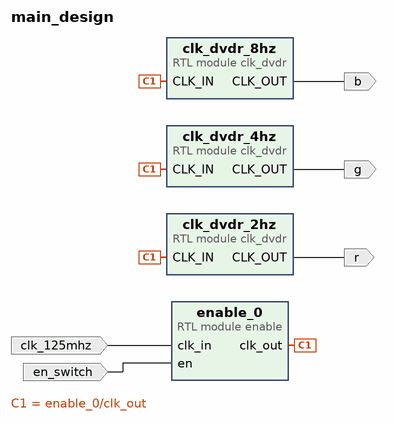
[diagram p0: block diagram of the top level]
# Vivado block design main_design, xc7z020clg400-1, Vivado 2022.1
create_bd_design main_design

create_bd_port -dir I -type clk clk_125mhz
set_property -dict {CONFIG.FREQ_HZ 125000000} [get_bd_ports clk_125mhz]
create_bd_port -dir O r
create_bd_port -dir O g
create_bd_port -dir O b
create_bd_port -dir I en_switch

create_bd_cell -type module -reference clk_dvdr clk_dvdr_2hz
set_property -dict {CONFIG.DIVISOR 0x3B9ACA0} [get_bd_cells clk_dvdr_2hz]
create_bd_cell -type module -reference clk_dvdr clk_dvdr_4hz
set_property -dict {CONFIG.DIVISOR 0x1DCD650} [get_bd_cells clk_dvdr_4hz]
create_bd_cell -type module -reference clk_dvdr clk_dvdr_8hz
set_property -dict {CONFIG.DIVISOR 0x0EE6B28} [get_bd_cells clk_dvdr_8hz]
create_bd_cell -type module -reference enable enable_0

# ---- connections ----

connect_bd_net [get_bd_ports clk_125mhz] [get_bd_pins enable_0/clk_in]
connect_bd_net -net clk_dvdr_0_CLK_OUT [get_bd_pins clk_dvdr_2hz/CLK_OUT] [get_bd_ports r]
connect_bd_net -net clk_dvdr_1_CLK_OUT [get_bd_pins clk_dvdr_4hz/CLK_OUT] [get_bd_ports g]
connect_bd_net -net clk_dvdr_2_CLK_OUT [get_bd_pins clk_dvdr_8hz/CLK_OUT] [get_bd_ports b]
connect_bd_net [get_bd_ports en_switch] [get_bd_pins enable_0/en]
connect_bd_net [get_bd_pins enable_0/clk_out] [get_bd_pins clk_dvdr_4hz/CLK_IN] [get_bd_pins clk_dvdr_2hz/CLK_IN] [get_bd_pins clk_dvdr_8hz/CLK_IN]

validate_bd_design
save_bd_design
